# Altium schematic sheet Steering Wheel Interface Digital Inputs.SchDoc: Steering Wheel Interface - Digital Inputs
size B; Organization: Midnight Sun Solar Rayce Car Team; Address1: University of Waterloo; Address2: 200 University Ave W; Address3: Waterloo, ON, Canada; Address4: N2L 3E9; DocumentNumber: 3; SheetNumber: 4; SheetTotal: 5; Website: www.uwmidsun.com; ProjectName: ProjectName
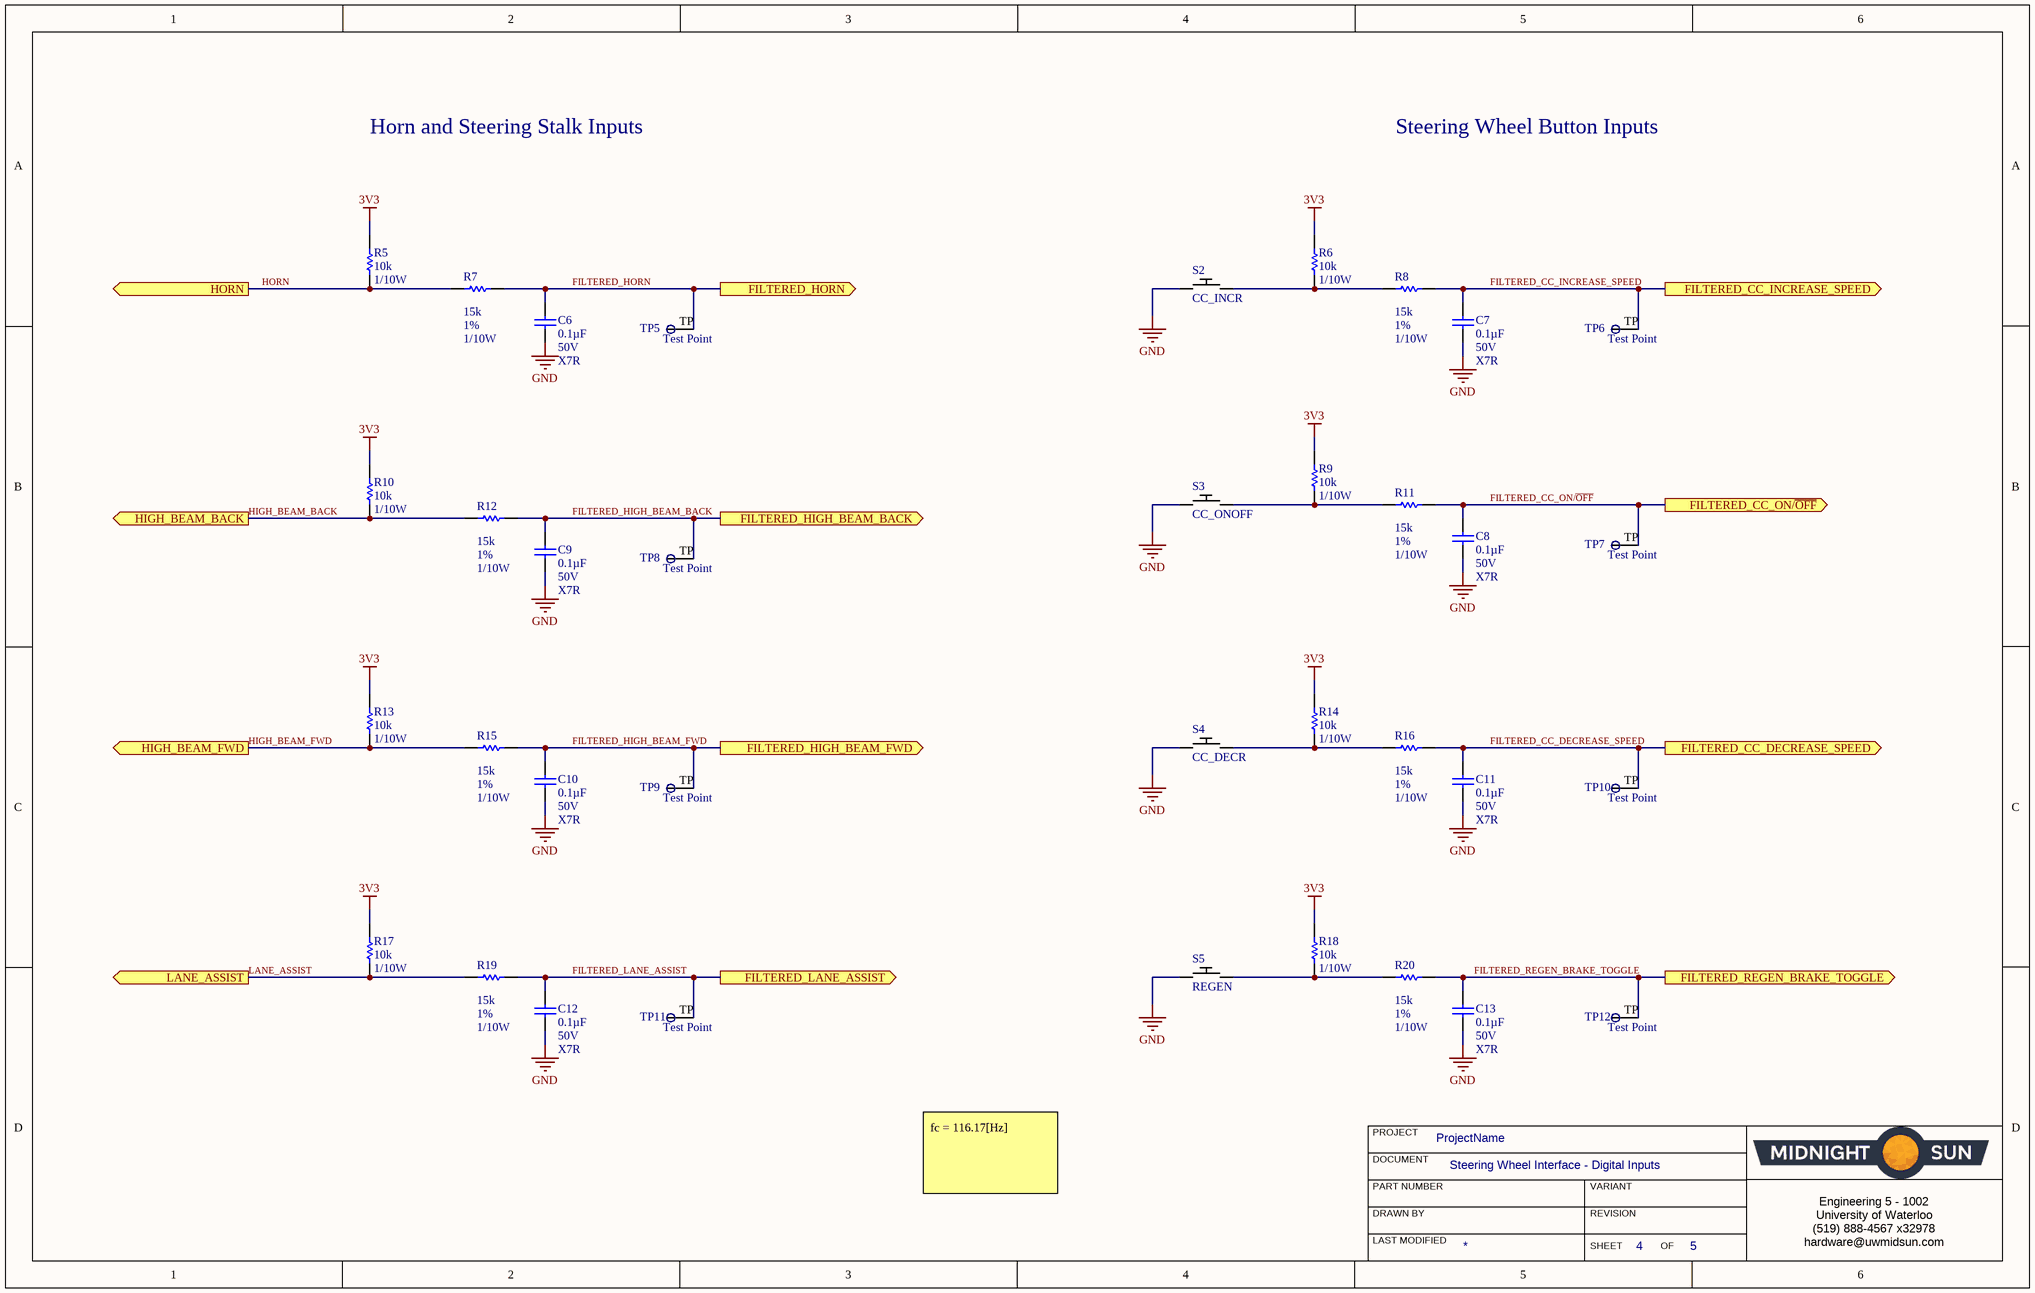
[diagram p0: Steering Wheel Interface Digital Inputs.SchDoc]

## Parts
C6  Capacitance: 0.1µF  Voltage: 50V  Temperature Coefficient: X7R  [CAP, 0603]  (hidden comment: CAP CER 0.1UF 50V 10% X7R 0603)
C7  Capacitance: 0.1µF  Voltage: 50V  Temperature Coefficient: X7R  [CAP, 0603]  (hidden comment: CAP CER 0.1UF 50V 10% X7R 0603)
C8  Capacitance: 0.1µF  Voltage: 50V  Temperature Coefficient: X7R  [CAP, 0603]  (hidden comment: CAP CER 0.1UF 50V 10% X7R 0603)
C9  Capacitance: 0.1µF  Voltage: 50V  Temperature Coefficient: X7R  [CAP, 0603]  (hidden comment: CAP CER 0.1UF 50V 10% X7R 0603)
C10  Capacitance: 0.1µF  Voltage: 50V  Temperature Coefficient: X7R  [CAP, 0603]  (hidden comment: CAP CER 0.1UF 50V 10% X7R 0603)
C11  Capacitance: 0.1µF  Voltage: 50V  Temperature Coefficient: X7R  [CAP, 0603]  (hidden comment: CAP CER 0.1UF 50V 10% X7R 0603)
C12  Capacitance: 0.1µF  Voltage: 50V  Temperature Coefficient: X7R  [CAP, 0603]  (hidden comment: CAP CER 0.1UF 50V 10% X7R 0603)
C13  Capacitance: 0.1µF  Voltage: 50V  Temperature Coefficient: X7R  [CAP, 0603]  (hidden comment: CAP CER 0.1UF 50V 10% X7R 0603)
R5  Resistance: 10k  Power: 1/10W  [RES, 0603]  (hidden comment: RES 10K OHM 1% 1/10W 0603)
R6  Resistance: 10k  Power: 1/10W  [RES, 0603]  (hidden comment: RES 10K OHM 1% 1/10W 0603)
R7  Resistance: 15k  Tolerance: 1%  Max Power Dissipation: 1/10W  [RES, 0603]  (hidden comment: RES SMD 15K OHM 1% 1/10W 0603)
R8  Resistance: 15k  Tolerance: 1%  Max Power Dissipation: 1/10W  [RES, 0603]  (hidden comment: RES SMD 15K OHM 1% 1/10W 0603)
R9  Resistance: 10k  Power: 1/10W  [RES, 0603]  (hidden comment: RES 10K OHM 1% 1/10W 0603)
R10  Resistance: 10k  Power: 1/10W  [RES, 0603]  (hidden comment: RES 10K OHM 1% 1/10W 0603)
R11  Resistance: 15k  Tolerance: 1%  Max Power Dissipation: 1/10W  [RES, 0603]  (hidden comment: RES SMD 15K OHM 1% 1/10W 0603)
R12  Resistance: 15k  Tolerance: 1%  Max Power Dissipation: 1/10W  [RES, 0603]  (hidden comment: RES SMD 15K OHM 1% 1/10W 0603)
R13  Resistance: 10k  Power: 1/10W  [RES, 0603]  (hidden comment: RES 10K OHM 1% 1/10W 0603)
R14  Resistance: 10k  Power: 1/10W  [RES, 0603]  (hidden comment: RES 10K OHM 1% 1/10W 0603)
R15  Resistance: 15k  Tolerance: 1%  Max Power Dissipation: 1/10W  [RES, 0603]  (hidden comment: RES SMD 15K OHM 1% 1/10W 0603)
R16  Resistance: 15k  Tolerance: 1%  Max Power Dissipation: 1/10W  [RES, 0603]  (hidden comment: RES SMD 15K OHM 1% 1/10W 0603)
R17  Resistance: 10k  Power: 1/10W  [RES, 0603]  (hidden comment: RES 10K OHM 1% 1/10W 0603)
R18  Resistance: 10k  Power: 1/10W  [RES, 0603]  (hidden comment: RES 10K OHM 1% 1/10W 0603)
R19  Resistance: 15k  Tolerance: 1%  Max Power Dissipation: 1/10W  [RES, 0603]  (hidden comment: RES SMD 15K OHM 1% 1/10W 0603)
R20  Resistance: 15k  Tolerance: 1%  Max Power Dissipation: 1/10W  [RES, 0603]  (hidden comment: RES SMD 15K OHM 1% 1/10W 0603)
S2  CC_INCR  [SW SPST-NO ESE-20C321]
S3  CC_ONOFF  [SW SPST-NO ESE-20C321]
S4  CC_DECR  [SW SPST-NO ESE-20C321]
S5  REGEN  [SW SPST-NO ESE-20C321]
TP5  Test Point  [Test Point]  (no BOM)
TP6  Test Point  [Test Point]  (no BOM)
TP7  Test Point  [Test Point]  (no BOM)
TP8  Test Point  [Test Point]  (no BOM)
TP9  Test Point  [Test Point]  (no BOM)
TP10  Test Point  [Test Point]  (no BOM)
TP11  Test Point  [Test Point]  (no BOM)
TP12  Test Point  [Test Point]  (no BOM)

## Ports
FILTERED_CC_DECREASE_SPEED (out), FILTERED_CC_INCREASE_SPEED (out), FILTERED_CC_ON/~{OFF} (out), FILTERED_HIGH_BEAM_BACK (out), FILTERED_HIGH_BEAM_FWD (out), FILTERED_HORN (out), FILTERED_LANE_ASSIST (out), FILTERED_REGEN_BRAKE_TOGGLE (out), HIGH_BEAM_BACK (out), HIGH_BEAM_FWD (out), HORN (out), LANE_ASSIST (out)

## Nets
3V3: R5.1 R6.1 R9.1 R10.1 R13.1 R14.1 R17.1 R18.1
GND: C6.2 C7.2 C8.2 C9.2 C10.2 C11.2 C12.2 C13.2 S2.1 S3.1 S4.1 S5.1
FILTERED_CC_DECREASE_SPEED: C11.1 R16.1 TP10.TP ; port FILTERED_CC_DECREASE_SPEED
FILTERED_CC_INCREASE_SPEED: C7.1 R8.1 TP6.TP ; port FILTERED_CC_INCREASE_SPEED
FILTERED_CC_ON/~{OFF}: C8.1 R11.1 TP7.TP ; port FILTERED_CC_ON/~{OFF}
FILTERED_HIGH_BEAM_BACK: C9.1 R12.1 TP8.TP ; port FILTERED_HIGH_BEAM_BACK
FILTERED_HIGH_BEAM_FWD: C10.1 R15.1 TP9.TP ; port FILTERED_HIGH_BEAM_FWD
FILTERED_HORN: C6.1 R7.1 TP5.TP ; port FILTERED_HORN
FILTERED_LANE_ASSIST: C12.1 R19.1 TP11.TP ; port FILTERED_LANE_ASSIST
FILTERED_REGEN_BRAKE_TOGGLE: C13.1 R20.1 TP12.TP ; port FILTERED_REGEN_BRAKE_TOGGLE
HIGH_BEAM_BACK: R10.2 R12.2 ; port HIGH_BEAM_BACK
HIGH_BEAM_FWD: R13.2 R15.2 ; port HIGH_BEAM_FWD
HORN: R5.2 R7.2 ; port HORN
LANE_ASSIST: R17.2 R19.2 ; port LANE_ASSIST
NetR6_2: R6.2 R8.2 S2.2
NetR9_2: R9.2 R11.2 S3.2
NetR14_2: R14.2 R16.2 S4.2
NetR18_2: R18.2 R20.2 S5.2

## Notes on the sheet
- Horn and Steering Stalk Inputs
- Steering Wheel Button Inputs
- PROJECT
- DOCUMENT
- fc = 116.17[Hz]
- DRAWN BY
- LAST MODIFIED
- PART NUMBER
- REVISION
- SHEET
- VARIANT
- OF
- Engineering 5 - 1002
  University of Waterloo
  (519) 888-4567 x32978
  hardware@uwmidsun.com

## Library data of the parts
C6-C13 = CAP CER 0.1UF 50V 10% X7R 0603: 0.10µF ±10% 50V Ceramic Capacitor X7R 0603 (1608 Metric); Manufacturer 1: AVX Corporation; Manufacturer Part Number 1: 06035C104KAT2A; Supplier 1: Digi-Key; Supplier Part Number 1: 478-5052-1-ND; Packaging: Cut Tape (CT); Part Status: Active; Operating Temperature: -55°C ~ 125°C; Ratings: -; Mounting Type: Surface Mount, MLCC; Package / Case: 0603 (1608 Metric); Size / Dimension: 0.063" L x 0.032" W (1.60mm x 0.81mm); Height - Seated (Max): -; Thickness (Max): 0.035" (0.90mm); Lead Spacing: -; Lead Style: -; ComponentLink1URL: http://datasheets.avx.com/X7RDielectric.pdf; ComponentLink1Description: http://datasheets.avx.com/X7RDielectric.pdf; Tolerance: ±10%
R5 R6 R9 R10 R13 R14 R17 R18 = RES 10K OHM 1% 1/10W 0603: RES SMD 10K OHM 1% 1/10W 0603; Manufacturer 1: Yageo; Manufacturer Part Number 1: RC0603FR-0710KL; Temperature Coefficient: ±100ppm/°C; Supplier 1: Digi-Key; Supplier Part Number 1: 311-10.0KHRCT-ND; Packaging: Cut Tape (CT); Part Status: Active; Composition: Thick Film; Operating Temperature: -55°C ~ 155°C; Package / Case: 0603 (1608 Metric); Supplier Device Package: 0603; Size / Dimension: 0.063" L x 0.031" W (1.60mm x 0.80mm); Height - Seated (Max): 0.022" (0.55mm); Failure Rate: -; ComponentLink1URL: http://www.yageo.com/documents/recent/PYu-RC_Group_51_RoHS_L_7.pdf; ComponentLink1Description: http://www.yageo.com/documents/recent/PYu-RC_Group_51_RoHS_L_7.pdf; Tolerance: ±1%
R7 R8 R11 R12 R15 R16 R19 R20 = RES SMD 15K OHM 1% 1/10W 0603: 15 kOhms ±1% 0.1W, 1/10W Chip Resistor 0603 (1608 Metric) Moisture Resistant Thick Film; Manufacturer: Yageo; Manufacturer Part Number: RC0603FR-0715KL; Power Rating: 100mW; Voltage Rating: 50V; Temperature Coefficient: 100ppm/°C; Case/Package: 0603; Case Code (Imperial): 0603; Case Code (Metric): 1608; Min Operating Temperature: -55°C; Max Operating Temperature: 155°C; Packaging: Tape and Reel; Termination: SMD/SMT; Composition: Thick Film; Military Standard: Not; Voltage Rating (DC): 50V; Length: 1.6mm; Height: 0.022inch; Width: 0.031inch; Depth: 0.8mm; Lead Free: Lead Free; ComponentLink1URL: https://www.digikey.ca/product-detail/en/yageo/RC0603FR-0715KL/311-15.0KHRCT-ND/729900; ComponentLink1Description: Digikey; Features: Moisture Resistant; Number of Pins: 2; Number of Terminations: 2; Package Quantity: 1; REACH SVHC: Unknown; Supplier 1: Digi-Key; RoHS: Yes; Stock 1: 8611420; Pricing 1: 1 = 0.10000, 10 = 0.02400, 100 = 0.00970, 1000 = 0.00437, 2500 = 0.00379 (USD); ComponentLink2URL: http://www.yageo.com/documents/recent/PYu-RC_Group_51_RoHS_L_10.pdf; ComponentLink2Description: http://www.yageo.com/documents/recent/PYu-RC_Group_51_RoHS_L_10.pdf; ComponentLink3URL: http://www.yageo.com/documents/recent/PYu-RC_Group_51_RoHS_L_9.pdf; ComponentLink3Description: http://www.yageo.com/documents/recent/PYu-RC_Group_51_RoHS_L_9.pdf; ComponentLink4URL: https://www.verical.com/server-webapp/html/getDatasheet?partID=327895; ComponentLink4Description: https://www.verical.com/server-webapp/html/getDatasheet?partID=327895; Supplier Part Number 1: 311-15.0KHRCT-ND
S2-S5 = SW PUSH SPST-NO 0.1A 14V: Pushbutton Switch SPST-NO Standard Through Hole; Manufacturer: Panasonic; Manufacturer Part Number: ESE20C321; Switch Function: Off-Mom; Actuator Type: Square, Button; Operating Force: 4N; Voltage Rating (DC): 14V; Throw Configuration: SPST; Current Rating: 100mA; Supplier 1: Digi-Key; Supplier Part Number 1: P11161S-ND; RoHS: Yes; Stock 1: 1919; Pricing 1: 1 = 1.17000, 10 = 1.09200, 25 = 1.04040, 50 = 0.98820, 100 = 0.96220, 250 = 0.93620, 500 = 0.88418, 1000 = 0.83216, 5000 = 0.70214 (USD); Packaging: Bulk; ComponentLink1URL: https://www.digikey.ca/product-detail/en/panasonic-electronic-components/ESE-20C321/P11161S-ND/354749; ComponentLink1Description: Digikey; Mount: Through Hole; Min Operating Temperature: -30°C; Max Operating Temperature: 80°C; Max Voltage Rating (DC): 14V; Package Quantity: 1200; Contact Current Rating: 100mA; Termination: PC Pin; Orientation: Straight; Radiation Hardening: No; REACH SVHC: No SVHC; Lead Free: Lead Free; ComponentLink2URL: https://datasheet.ciiva.com/46399/1790644-46399477.pdf?src-supplier=Element14; ComponentLink2Description: https://datasheet.ciiva.com/46399/1790644-46399477.pdf?src-supplier=Element14; ComponentLink3URL: https://datasheet.ciiva.com/16437/atu0000ce7-16437878.pdf?src-supplier=Future+Electronics; ComponentLink3Description: https://datasheet.ciiva.com/16437/atu0000ce7-16437878.pdf?src-supplier=Future+Electronics; ComponentLink4URL: https://datasheet.ciiva.com/8663/atu0000ce7-8663607.pdf?src-supplier=Avnet; ComponentLink4Description: https://datasheet.ciiva.com/8663/atu0000ce7-8663607.pdf?src-supplier=Avnet; ComponentLink5URL: https://datasheet.ciiva.com/2869/atu0000ce7-2869467.pdf?src-supplier=Digi-Key; ComponentLink5Description: https://datasheet.ciiva.com/2869/atu0000ce7-2869467.pdf?src-supplier=Digi-Key